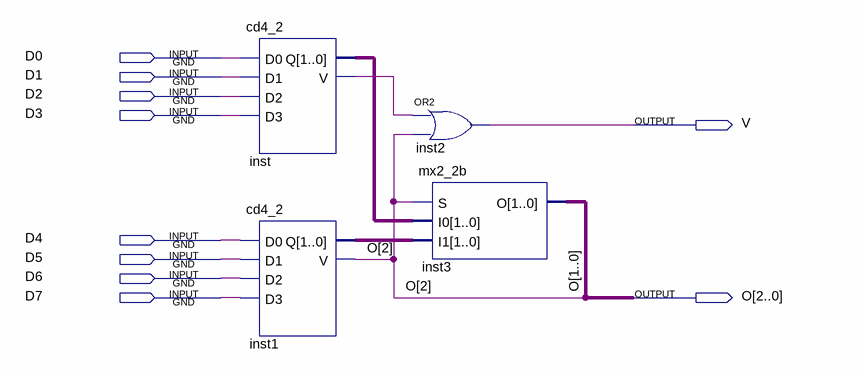
[diagram p0: schematic sheet]
// Quartus schematic cd8_3.bdf as structural Verilog: 4 symbols, 10 pins
module cd8_3 (
  input  D0,
  input  D1,
  input  D2,
  input  D3,
  input  D4,
  input  D5,
  input  D6,
  input  D7,
  output V,
  output [2:0] O
);

  wire inst_v;
  wire [1:0] inst1_q, inst_q;

  cd4_2 inst (.D0(D0), .D1(D1), .D2(D2), .D3(D3), .Q(inst_q), .V(inst_v));
  cd4_2 inst1 (.D0(D4), .D1(D5), .D2(D6), .D3(D7), .Q(inst1_q), .V(O[2]));
  or inst2 (V, inst_v, O[2]);
  mx2_2b inst3 (.S(O[2]), .I0(inst_q), .I1(inst1_q), .O(O[1:0]));
endmodule
